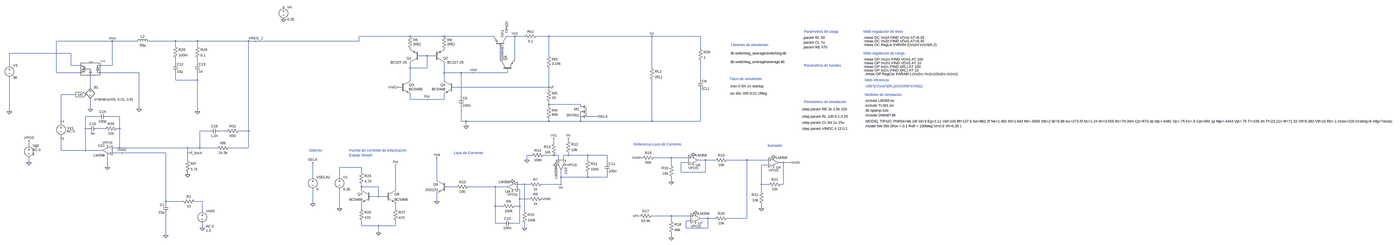
[diagram p0: schematic Regulador_completo_v2_average.asc, whole sheet]
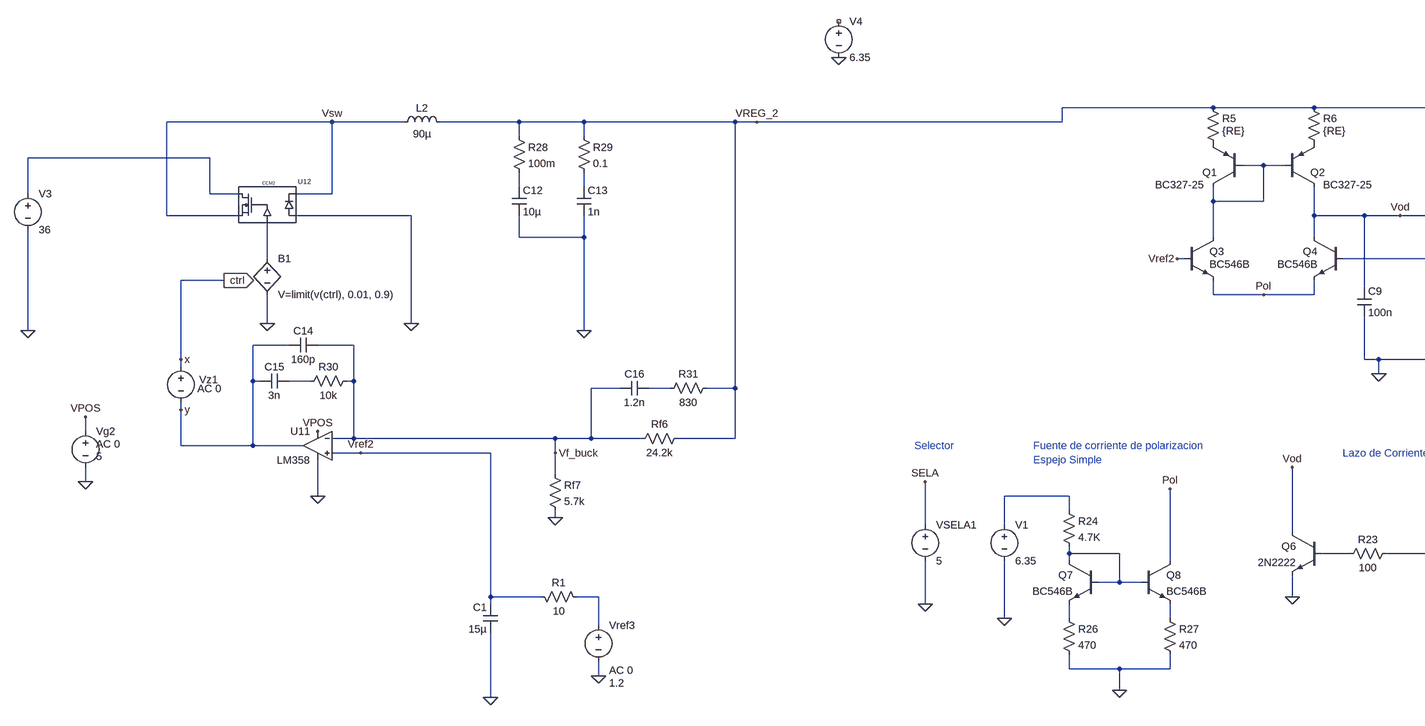
[diagram p1: schematic Regulador_completo_v2_average.asc, part, row 1 of 1, column 1 of 3]
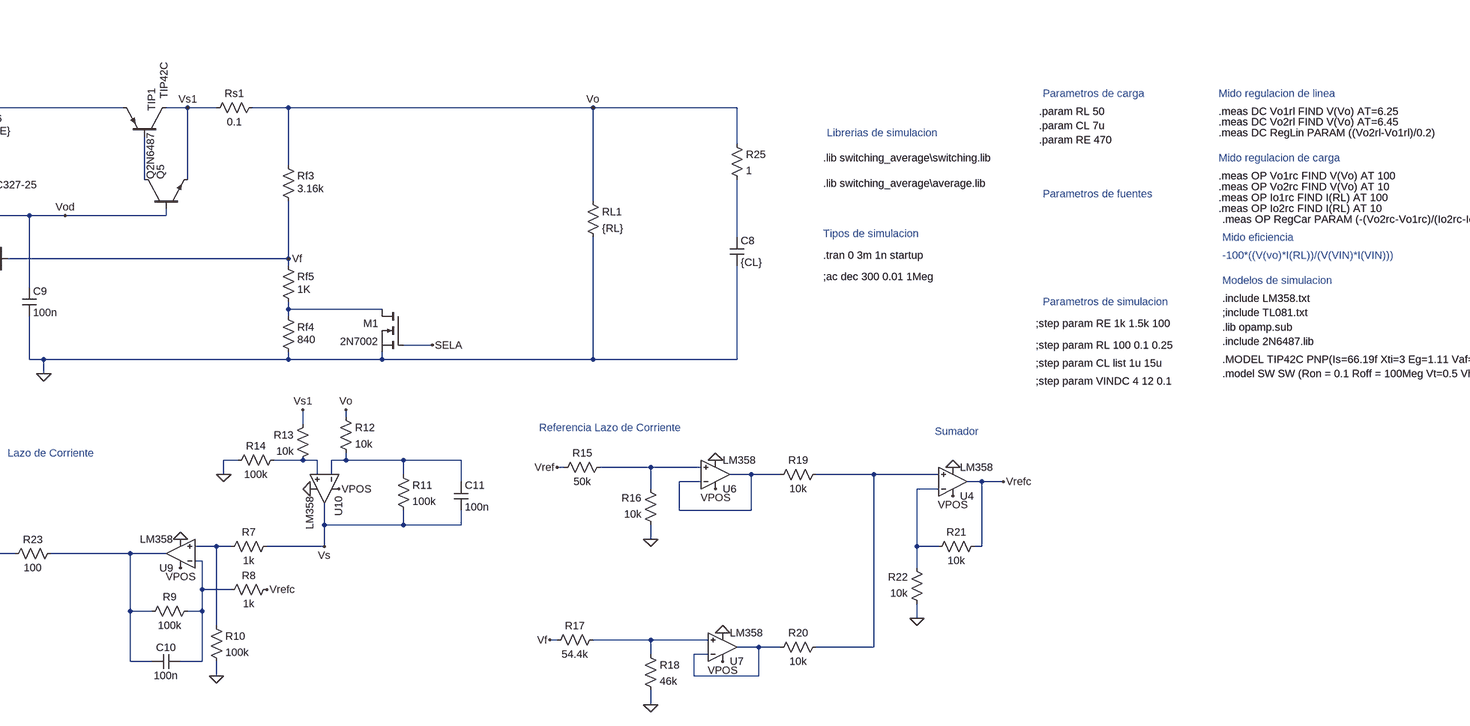
[diagram p2: schematic Regulador_completo_v2_average.asc, part, row 1 of 1, column 2 of 3]
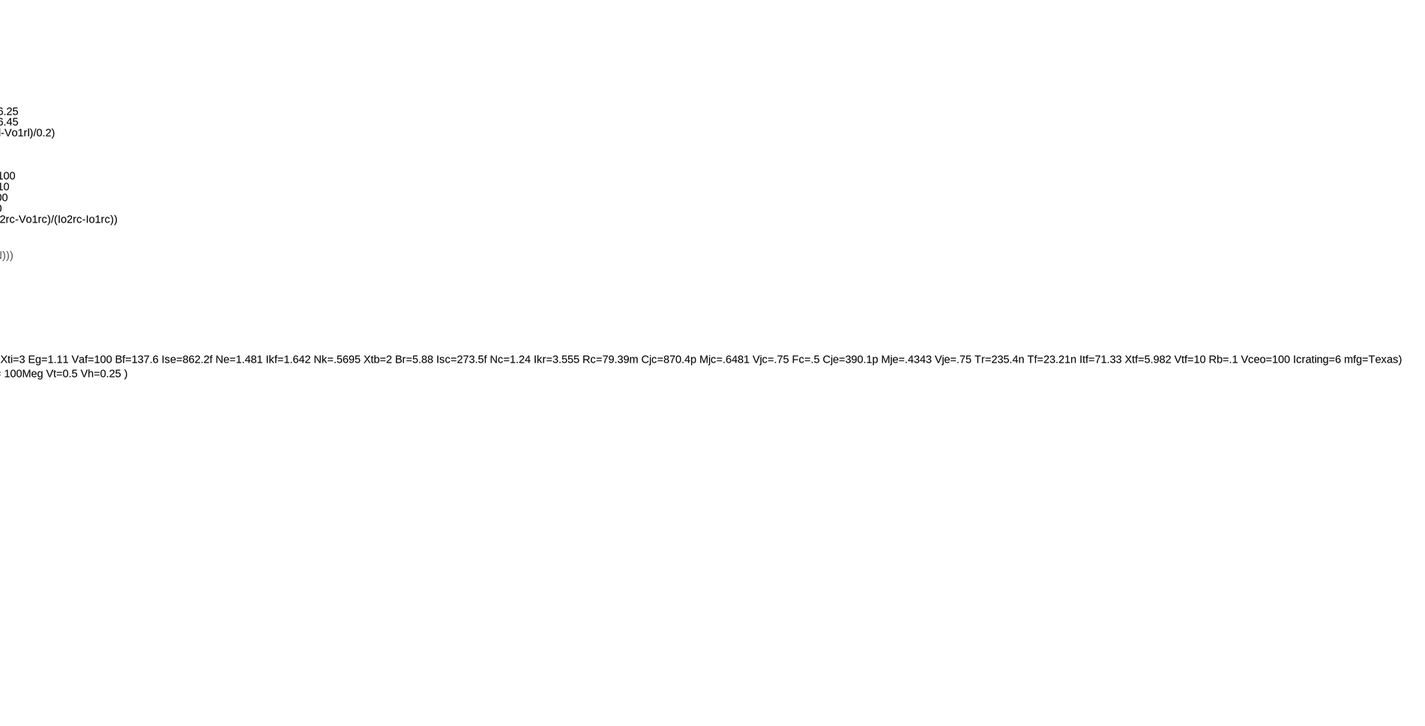
[diagram p3: schematic Regulador_completo_v2_average.asc, part, row 1 of 1, column 3 of 3]
Regulador_completo_v2_average.asc, the LTspice schematic file:
Version 4
SHEET 1 10072 1956
WIRE 3136 -768 2800 -768
WIRE 3360 -768 3136 -768
WIRE 3680 -768 3360 -768
WIRE 3824 -768 3776 -768
WIRE 3888 -768 3824 -768
WIRE 4048 -768 3968 -768
WIRE 4752 -768 4048 -768
WIRE 5072 -768 4752 -768
WIRE 1008 -736 640 -736
WIRE 1168 -736 1008 -736
WIRE 1424 -736 1248 -736
WIRE 1568 -736 1424 -736
WIRE 1904 -736 1568 -736
WIRE 1952 -736 1904 -736
WIRE 2800 -736 2800 -768
WIRE 2800 -736 1952 -736
WIRE 1424 -704 1424 -736
WIRE 1568 -704 1568 -736
WIRE 5072 -688 5072 -768
WIRE 736 -656 272 -656
WIRE 3248 -640 3200 -640
WIRE 3296 -640 3248 -640
WIRE 4048 -640 4048 -768
WIRE 3728 -608 3728 -704
WIRE 3824 -608 3824 -768
WIRE 1424 -592 1424 -624
WIRE 1568 -592 1568 -624
WIRE 272 -576 272 -656
WIRE 736 -576 736 -656
WIRE 800 -576 736 -576
WIRE 1008 -576 1008 -736
WIRE 1008 -576 928 -576
WIRE 3136 -560 3136 -592
WIRE 3248 -560 3248 -640
WIRE 3248 -560 3136 -560
WIRE 4752 -560 4752 -768
WIRE 640 -528 640 -736
WIRE 800 -528 640 -528
WIRE 1184 -528 928 -528
WIRE 3360 -528 3360 -592
WIRE 3472 -528 3360 -528
WIRE 3552 -528 3472 -528
WIRE 3776 -528 3776 -544
WIRE 3776 -528 3552 -528
WIRE 1424 -480 1424 -528
WIRE 1568 -480 1568 -528
WIRE 1568 -480 1424 -480
WIRE 3136 -480 3136 -560
WIRE 3360 -480 3360 -528
WIRE 5072 -480 5072 -608
WIRE 864 -432 864 -512
WIRE 3072 -432 3056 -432
WIRE 4048 -432 4048 -560
WIRE 4048 -432 3424 -432
WIRE 4048 -416 4048 -432
WIRE 768 -384 672 -384
WIRE 3472 -368 3472 -528
WIRE 3136 -352 3136 -384
WIRE 3248 -352 3136 -352
WIRE 3360 -352 3360 -384
WIRE 3360 -352 3248 -352
WIRE 4048 -320 4048 -336
WIRE 4256 -320 4048 -320
WIRE 4048 -304 4048 -320
WIRE 864 -288 864 -352
WIRE 1184 -288 1184 -528
WIRE 272 -272 272 -496
WIRE 1568 -272 1568 -480
WIRE 912 -240 832 -240
WIRE 1056 -240 976 -240
WIRE 4368 -240 4304 -240
WIRE 672 -208 672 -384
WIRE 3472 -208 3472 -304
WIRE 3504 -208 3472 -208
WIRE 4048 -208 4048 -224
WIRE 4048 -208 3504 -208
WIRE 4256 -208 4256 -224
WIRE 4256 -208 4048 -208
WIRE 4752 -208 4752 -480
WIRE 4752 -208 4256 -208
WIRE 5072 -208 5072 -416
WIRE 5072 -208 4752 -208
WIRE 672 -192 672 -208
WIRE 3504 -176 3504 -208
WIRE 832 -160 832 -240
WIRE 848 -160 832 -160
WIRE 960 -160 912 -160
WIRE 1056 -160 1056 -240
WIRE 1056 -160 1040 -160
WIRE 1648 -144 1584 -144
WIRE 1760 -144 1712 -144
WIRE 1904 -144 1904 -736
WIRE 1904 -144 1840 -144
WIRE 672 -96 672 -112
WIRE 4176 -80 4176 -96
WIRE 4080 -64 4080 -96
WIRE 400 -48 400 -80
WIRE 1056 -32 1056 -160
WIRE 1056 -32 1008 -32
WIRE 1504 -32 1056 -32
WIRE 1584 -32 1584 -144
WIRE 1584 -32 1504 -32
WIRE 1696 -32 1584 -32
WIRE 1904 -32 1904 -144
WIRE 1904 -32 1776 -32
WIRE 672 -16 672 -96
WIRE 832 -16 832 -160
WIRE 832 -16 672 -16
WIRE 944 -16 832 -16
WIRE 1072 0 1008 0
WIRE 1360 0 1072 0
WIRE 1504 0 1504 -32
WIRE 3936 16 3904 16
WIRE 4080 16 4016 16
WIRE 4112 16 4080 16
WIRE 4176 16 4176 0
WIRE 4176 16 4144 16
WIRE 4304 16 4176 16
WIRE 4432 16 4304 16
WIRE 4688 32 4672 32
WIRE 4880 32 4768 32
WIRE 4992 32 4880 32
WIRE 1504 48 1504 0
WIRE 3904 48 3904 16
WIRE 4112 48 4112 16
WIRE 4144 48 4144 16
WIRE 4304 48 4304 16
WIRE 5104 48 5056 48
WIRE 5168 48 5104 48
WIRE 5376 48 5248 48
WIRE 5520 48 5376 48
WIRE 400 64 400 32
WIRE 4432 64 4432 16
WIRE 4992 64 4944 64
WIRE 5616 64 5584 64
WIRE 5664 64 5616 64
WIRE 4880 80 4880 32
WIRE 5520 80 5472 80
WIRE 976 96 976 16
WIRE 2816 96 2672 96
WIRE 2816 128 2816 96
WIRE 4944 128 4944 64
WIRE 5104 128 5104 48
WIRE 5104 128 4944 128
WIRE 1504 144 1504 128
WIRE 2496 160 2496 64
WIRE 2672 160 2672 96
WIRE 4128 160 4128 112
WIRE 4304 160 4304 128
WIRE 4304 160 4128 160
WIRE 4432 160 4432 128
WIRE 4432 160 4304 160
WIRE 3312 176 3312 32
WIRE 4880 192 4880 160
WIRE 3888 208 3840 208
WIRE 3920 208 3888 208
WIRE 4128 208 4128 160
WIRE 4128 208 4000 208
WIRE 5472 208 5472 80
WIRE 5520 208 5472 208
WIRE 5616 208 5616 64
WIRE 5616 208 5600 208
WIRE 2816 224 2816 208
WIRE 2928 224 2816 224
WIRE 3440 224 3376 224
WIRE 3696 224 3520 224
WIRE 3776 224 3696 224
WIRE 2816 240 2816 224
WIRE 3040 240 3040 80
WIRE 3856 240 3840 240
WIRE 5472 256 5472 208
WIRE 2928 288 2928 224
WIRE 2928 288 2880 288
WIRE 2976 288 2928 288
WIRE 3856 304 3856 240
WIRE 3920 304 3856 304
WIRE 1360 320 1360 0
WIRE 1472 320 1360 320
WIRE 1600 320 1552 320
WIRE 3312 320 3312 272
WIRE 1360 336 1360 320
WIRE 2496 336 2496 240
WIRE 3696 352 3696 224
WIRE 3744 352 3696 352
WIRE 3856 352 3856 304
WIRE 3856 352 3824 352
WIRE 2672 368 2672 240
WIRE 2816 368 2816 336
WIRE 3040 368 3040 336
WIRE 5472 368 5472 336
WIRE 1600 384 1600 320
WIRE 3888 384 3888 208
WIRE 4672 416 4656 416
WIRE 4880 416 4752 416
WIRE 5008 416 4880 416
WIRE 5120 432 5072 432
WIRE 5168 432 5120 432
WIRE 5376 432 5376 48
WIRE 5376 432 5248 432
WIRE 4880 448 4880 416
WIRE 5008 448 4976 448
WIRE 3696 464 3696 352
WIRE 3744 464 3696 464
WIRE 3856 464 3856 352
WIRE 3856 464 3808 464
WIRE 2816 480 2816 448
WIRE 2928 480 2816 480
WIRE 3040 480 3040 448
WIRE 3040 480 2928 480
WIRE 1600 496 1600 464
WIRE 3888 496 3888 464
WIRE 4976 496 4976 448
WIRE 5120 496 5120 432
WIRE 5120 496 4976 496
WIRE 2928 528 2928 480
WIRE 1360 544 1360 400
WIRE 4880 560 4880 528
FLAG 3504 -176 0
FLAG 4752 -768 Vo
FLAG 4048 -432 Vf
FLAG 3824 -768 Vs1
FLAG 3888 496 0
FLAG 3552 -528 Vod
FLAG 4000 304 Vrefc
FLAG 3904 48 0
FLAG 5472 368 0
FLAG 4880 560 0
FLAG 4880 192 0
FLAG 4368 -240 SELA
FLAG 2496 64 SELA
FLAG 2496 336 0
FLAG 5664 64 Vrefc
FLAG 4128 208 Vs
FLAG 3312 320 0
FLAG 3248 -352 Pol
FLAG 3040 80 Pol
FLAG 2928 528 0
FLAG 4080 -96 Vs1
FLAG 4176 -96 Vo
FLAG 3312 32 Vod
FLAG 4672 32 Vref
FLAG 4656 416 Vf
FLAG 5552 32 0
FLAG 5024 16 0
FLAG 5040 400 0
FLAG 3808 192 0
FLAG 4096 80 0
FLAG 272 -272 0
FLAG 1952 -736 VREG_2
FLAG 1184 -288 0
FLAG 1568 -272 0
FLAG 1008 -736 Vsw
FLAG 1504 144 0
FLAG 976 96 0
FLAG 1600 496 0
FLAG 864 -288 0
FLAG 768 -384 ctrl
IOPIN 768 -384 Out
FLAG 672 -208 x
FLAG 672 -96 y
FLAG 1504 0 Vf_buck
FLAG 400 64 0
FLAG 976 -48 VPOS
FLAG 400 -80 VPOS
FLAG 3808 256 VPOS
FLAG 4160 80 VPOS
FLAG 5024 80 VPOS
FLAG 5040 464 VPOS
FLAG 5552 96 VPOS
FLAG 1072 0 Vref2
FLAG 2672 368 0
FLAG 1360 544 0
FLAG 2304 -880 0
FLAG 3056 -432 Vref2
DATAFLAG 4288 -768 ""
SYMBOL pnp 3200 -592 R180
WINDOW 3 84 4 Left 2
SYMATTR Value BC327-25
SYMATTR InstName Q1
SYMBOL pnp 3296 -592 M180
WINDOW 3 84 4 Left 2
SYMATTR Value BC327-25
SYMATTR InstName Q2
SYMBOL npn 3072 -480 R0
WINDOW 3 56 60 Left 2
SYMATTR Value BC546B
SYMATTR InstName Q3
SYMBOL npn 3424 -480 M0
WINDOW 3 56 60 Left 2
SYMATTR Value BC546B
SYMATTR InstName Q4
SYMBOL pnp 3776 -704 M270
WINDOW 3 84 4 Left 2
SYMATTR Value TIP42C
SYMATTR InstName TIP1
SYMBOL npn 3728 -544 R270
WINDOW 3 65 14 Left 2
WINDOW 0 64 36 Left 2
SYMATTR Value Q2N6487
SYMATTR InstName Q5
SYMBOL res 4032 -656 R0
WINDOW 3 36 68 Left 2
SYMATTR Value 3.16k
SYMATTR InstName Rf3
SYMBOL res 4032 -320 R0
WINDOW 3 36 68 Left 2
SYMATTR Value 840
SYMATTR InstName Rf4
SYMBOL res 4736 -576 R0
SYMATTR InstName RL1
SYMATTR Value {RL}
SYMBOL res 3120 -784 R0
WINDOW 3 36 68 Left 2
SYMATTR Value {RE}
SYMATTR InstName R5
SYMBOL res 3344 -784 R0
WINDOW 3 36 68 Left 2
SYMATTR Value {RE}
SYMATTR InstName R6
SYMBOL cap 5056 -480 R0
SYMATTR InstName C8
SYMATTR Value {CL}
SYMBOL res 3984 -784 R90
WINDOW 0 0 56 VBottom 2
WINDOW 3 32 56 VTop 2
SYMATTR InstName Rs1
SYMATTR Value 0.1
SYMBOL res 4016 192 R90
WINDOW 0 0 56 VBottom 2
WINDOW 3 32 56 VTop 2
SYMATTR InstName R7
SYMATTR Value 1k
SYMBOL res 4016 288 R90
WINDOW 0 0 56 VBottom 2
WINDOW 3 32 56 VTop 2
SYMATTR InstName R8
SYMATTR Value 1k
SYMBOL res 3840 336 R90
WINDOW 0 0 56 VBottom 2
WINDOW 3 32 56 VTop 2
SYMATTR InstName R9
SYMATTR Value 100k
SYMBOL res 3872 368 R0
SYMATTR InstName R10
SYMATTR Value 100k
SYMBOL npn 3376 176 M0
SYMATTR InstName Q6
SYMATTR Value 2N2222
SYMBOL res 4288 32 R0
SYMATTR InstName R11
SYMATTR Value 100k
SYMBOL res 4160 -96 R0
SYMATTR InstName R12
SYMATTR Value 10k
SYMBOL res 4096 -80 M0
SYMATTR InstName R13
SYMATTR Value 10k
SYMBOL res 4032 0 R90
WINDOW 0 0 56 VBottom 2
WINDOW 3 32 56 VTop 2
SYMATTR InstName R14
SYMATTR Value 100k
SYMBOL res 4784 16 R90
WINDOW 0 0 56 VBottom 2
WINDOW 3 32 56 VTop 2
SYMATTR InstName R15
SYMATTR Value 50k
SYMBOL res 4896 176 R180
WINDOW 0 36 76 Left 2
WINDOW 3 36 40 Left 2
SYMATTR InstName R16
SYMATTR Value 10k
SYMBOL res 4656 432 R270
WINDOW 0 32 56 VTop 2
WINDOW 3 0 56 VBottom 2
SYMATTR InstName R17
SYMATTR Value 54.4k
SYMBOL res 4864 432 R0
SYMATTR InstName R18
SYMATTR Value 46k
SYMBOL res 5264 32 R90
WINDOW 0 0 56 VBottom 2
WINDOW 3 32 56 VTop 2
SYMATTR InstName R19
SYMATTR Value 10k
SYMBOL res 5264 416 R90
WINDOW 0 0 56 VBottom 2
WINDOW 3 32 56 VTop 2
SYMATTR InstName R20
SYMATTR Value 10k
SYMBOL res 5616 192 R90
WINDOW 0 0 56 VBottom 2
WINDOW 3 32 56 VTop 2
SYMATTR InstName R21
SYMATTR Value 10k
SYMBOL res 5488 352 R180
WINDOW 0 36 76 Left 2
WINDOW 3 36 40 Left 2
SYMATTR InstName R22
SYMATTR Value 10k
SYMBOL res 4032 -432 R0
WINDOW 3 36 68 Left 2
SYMATTR Value 1K
SYMATTR InstName Rf5
SYMBOL nmos 4304 -320 M0
SYMATTR InstName M1
SYMATTR Value 2N7002
SYMBOL voltage 2496 144 R0
WINDOW 123 0 0 Left 2
WINDOW 39 0 0 Left 2
SYMATTR InstName VSELA1
SYMATTR Value 5
SYMBOL res 3536 208 R90
WINDOW 0 0 56 VBottom 2
WINDOW 3 32 56 VTop 2
SYMATTR InstName R23
SYMATTR Value 100
SYMBOL npn 2880 240 M0
SYMATTR InstName Q7
SYMATTR Value BC546B
SYMBOL res 2800 112 R0
SYMATTR InstName R24
SYMATTR Value 4.7K
SYMBOL npn 2976 240 R0
SYMATTR InstName Q8
SYMATTR Value BC546B
SYMBOL cap 3456 -368 R0
SYMATTR InstName C9
SYMATTR Value 100n
SYMBOL Opamps\\opamp2 5552 128 M180
SYMATTR InstName U4
SYMATTR Value LM358
SYMBOL Opamps\\opamp2 5024 112 M180
SYMATTR InstName U6
SYMATTR Value LM358
SYMBOL Opamps\\opamp2 5040 496 M180
SYMATTR InstName U7
SYMATTR Value LM358
SYMBOL Opamps\\opamp2 3808 288 R180
SYMATTR InstName U9
SYMATTR Value LM358
SYMBOL Opamps\\opamp2 4192 80 R90
SYMATTR InstName U10
SYMATTR Value LM358
SYMBOL res 5056 -704 R0
SYMATTR InstName R25
SYMATTR Value 1
SYMBOL res 2800 352 R0
SYMATTR InstName R26
SYMATTR Value 470
SYMBOL res 3024 352 R0
SYMATTR InstName R27
SYMATTR Value 470
SYMBOL cap 3808 448 R90
WINDOW 0 0 32 VBottom 2
WINDOW 3 32 32 VTop 2
SYMATTR InstName C10
SYMATTR Value 100n
SYMBOL cap 4416 64 R0
SYMATTR InstName C11
SYMATTR Value 100n
SYMBOL voltage 272 -592 R0
WINDOW 123 0 0 Left 0
WINDOW 39 0 0 Left 0
SYMATTR InstName V3
SYMATTR Value 36
SYMBOL ind 1152 -720 R270
WINDOW 0 32 56 VTop 2
WINDOW 3 5 56 VBottom 2
SYMATTR InstName L2
SYMATTR Value 90µ
SYMBOL cap 1408 -592 R0
SYMATTR InstName C12
SYMATTR Value 10µ
SYMBOL cap 1552 -592 R0
SYMATTR InstName C13
SYMATTR Value 1n
SYMBOL res 1408 -720 R0
SYMATTR InstName R28
SYMATTR Value 100m
SYMBOL res 1552 -720 R0
SYMATTR InstName R29
SYMATTR Value 0.1
SYMBOL res 1792 -48 R90
WINDOW 0 0 56 VBottom 2
WINDOW 3 32 56 VTop 2
SYMATTR InstName Rf6
SYMATTR Value 24.2k
SYMBOL res 1488 32 R0
SYMATTR InstName Rf7
SYMATTR Value 5.7k
SYMBOL voltage 1600 368 R0
WINDOW 123 24 116 Left 2
WINDOW 39 0 0 Left 2
WINDOW 3 24 144 Left 2
SYMATTR Value2 AC 0
SYMATTR InstName Vref3
SYMATTR Value 1.2
SYMBOL bv 864 -448 R0
SYMATTR InstName B1
SYMATTR Value V=limit(v(ctrl), 0.01, 0.9)
SYMBOL voltage 672 -208 R0
WINDOW 0 41 45 Left 2
WINDOW 123 37 65 Left 2
WINDOW 39 0 0 Left 2
SYMATTR InstName Vz1
SYMATTR Value2 AC 0
SYMATTR Value ""
SYMBOL voltage 400 -64 R0
WINDOW 123 24 44 Left 2
WINDOW 39 0 0 Left 0
WINDOW 3 24 72 Left 2
SYMATTR Value2 AC 0
SYMATTR InstName Vg2
SYMATTR Value 5
SYMBOL Opamps\\opamp2 976 -80 M0
SYMATTR InstName U11
SYMATTR Value LM358
SYMBOL cap 976 -256 R90
WINDOW 0 0 32 VBottom 2
WINDOW 3 32 32 VTop 2
SYMATTR InstName C14
SYMATTR Value 160p
SYMBOL cap 912 -176 R90
WINDOW 0 0 32 VBottom 2
WINDOW 3 32 32 VTop 2
SYMATTR InstName C15
SYMATTR Value 3n
SYMBOL res 1056 -176 R90
WINDOW 0 0 56 VBottom 2
WINDOW 3 32 56 VTop 2
SYMATTR InstName R30
SYMATTR Value 10k
SYMBOL cap 1712 -160 R90
WINDOW 0 0 32 VBottom 2
WINDOW 3 32 32 VTop 2
SYMATTR InstName C16
SYMATTR Value 1.2n
SYMBOL res 1856 -160 R90
WINDOW 0 0 56 VBottom 2
WINDOW 3 32 56 VTop 2
SYMATTR InstName R31
SYMATTR Value 830
SYMBOL ccm1 864 -544 R0
SYMATTR InstName U12
SYMATTR Value CCM2
SYMATTR SpiceLine Ron=0.16
SYMATTR SpiceLine2 VD=0 RD=0.16
SYMBOL voltage 2672 144 R0
WINDOW 123 0 0 Left 0
WINDOW 39 0 0 Left 0
SYMATTR InstName V1
SYMATTR Value 6.35
SYMBOL res 1456 304 M90
WINDOW 0 0 56 VBottom 2
WINDOW 3 32 56 VTop 2
SYMATTR InstName R1
SYMATTR Value 10
SYMBOL cap 1376 336 M0
SYMATTR InstName C1
SYMATTR Value 15µ
SYMBOL voltage 2304 -976 R0
WINDOW 123 0 0 Left 0
WINDOW 39 0 0 Left 0
SYMATTR InstName V4
SYMATTR Value 6.35
TEXT 5264 -656 Left 2 !.lib switching_average\\switching.lib
TEXT 5264 -600 Left 2 !.lib switching_average\\average.lib
TEXT 5272 -712 Left 2 ;Librerias de simulacion
TEXT 5264 -440 Left 2 !.tran 0 3m 1n startup
TEXT 5264 -392 Left 2 !;ac dec 300 0.01 1Meg
TEXT 5264 -488 Left 2 ;Tipos de simulacion
TEXT 5744 -760 Left 2 !.param RL 50
TEXT 5736 -288 Left 2 !;step param RE 1k 1.5k 100
TEXT 5744 -696 Left 2 !.param RE 470
TEXT 5736 -240 Left 2 !;step param RL 100 0.1 0.25
TEXT 6208 -800 Left 2 ;Mido regulacion de linea
TEXT 6208 -760 Left 2 !.meas DC Vo1rl FIND V(Vo) AT=6.25
TEXT 6208 -736 Left 2 !.meas DC Vo2rl FIND V(Vo) AT=6.45
TEXT 6208 -712 Left 2 !.meas DC RegLin PARAM ((Vo2rl-Vo1rl)/0.2)
TEXT 6208 -656 Left 2 ;Mido regulacion de carga
TEXT 6208 -616 Left 2 !.meas OP Vo1rc FIND V(Vo) AT 100
TEXT 6208 -592 Left 2 !.meas OP Vo2rc FIND V(Vo) AT 10
TEXT 6208 -568 Left 2 !.meas OP Io1rc FIND I(RL) AT 100
TEXT 6208 -544 Left 2 !.meas OP Io2rc FIND I(RL) AT 10
TEXT 6216 -480 Left 2 ;Mido eficiencia
TEXT 6216 -440 Left 2 ;-100*((V(vo)*I(RL))/(V(VIN)*I(VIN)))
TEXT 6216 -520 Left 2 !.meas OP RegCar PARAM (-(Vo2rc-Vo1rc)/(Io2rc-Io1rc))
TEXT 3424 0 Left 2 ;Lazo de Corriente
TEXT 6216 -312 Left 2 !;include TL081.txt
TEXT 4632 -56 Left 2 ;Referencia Lazo de Corriente
TEXT 5736 -160 Left 2 !;step param VINDC 4 12 0.1
TEXT 5512 -48 Left 2 ;Sumador
TEXT 2472 -16 Left 2 ;Selector
TEXT 6216 -280 Left 2 !.lib opamp.sub
TEXT 2736 -16 Left 2 ;Fuente de corriente de polarizacion\nEspejo Simple
TEXT 5744 -728 Left 2 !.param CL 7u
TEXT 5752 -800 Left 2 ;Parametros de carga
TEXT 5752 -576 Left 2 ;Parametros de fuentes
TEXT 5752 -336 Left 2 ;Parametros de simulacion
TEXT 6216 -384 Left 2 ;Modelos de simulacion
TEXT 5736 -200 Left 2 !;step param CL list 1u 15u
TEXT 6216 -208 Left 2 !.MODEL TIP42C PNP(Is=66.19f Xti=3 Eg=1.11 Vaf=100 Bf=137.6 Ise=862.2f Ne=1.481 Ikf=1.642 Nk=.5695 Xtb=2 Br=5.88 Isc=273.5f Nc=1.24 Ikr=3.555 Rc=79.39m Cjc=870.4p Mjc=.6481 Vjc=.75 Fc=.5 Cje=390.1p Mje=.4343 Vje=.75 Tr=235.4n Tf=23.21n Itf=71.33 Xtf=5.982 Vtf=10 Rb=.1 Vceo=100 Icrating=6 mfg=Texas)
TEXT 6216 -248 Left 2 !.include 2N6487.lib
TEXT 6216 -344 Left 2 !.include LM358.txt
TEXT 6216 -176 Left 2 !.model SW SW (Ron = 0.1 Roff = 100Meg Vt=0.5 Vh=0.25 )

The netlist it stands for:
* Regulador_completo_v2_average.asc
Q1 N002 N002 P001 0 BC327-25
Q2 Vod N002 P002 0 BC327-25
Q3 N002 Vref2 Pol 0 BC546B
Q4 Vod Vf Pol 0 BC546B
Q§TIP1 Vs1 N003 VREG_2 0 TIP42C
Q5 N003 Vod Vs1 0 Q2N6487
Rf3 Vo Vf 3.16k
Rf4 N008 0 840
RL1 Vo 0 {RL}
R5 VREG_2 P001 {RE}
R6 VREG_2 P002 {RE}
C8 N006 0 {CL}
Rs1 Vo Vs1 0.1
R7 Vs N018 1k
R8 Vrefc N022 1k
R9 N022 N021 100k
R10 N018 0 100k
Q6 Vod N020 0 0 2N2222
R11 N012 Vs 100k
R12 Vo N012 10k
R13 Vs1 N011 10k
R14 N011 0 100k
R15 N013 Vref 50k
R16 0 N013 10k
R17 Vf N026 54.4k
R18 N026 0 46k
R19 N015 N014 10k
R20 N015 N027 10k
R21 Vrefc N016 10k
R22 0 N016 10k
Rf5 Vf N008 1K
M1 N008 SELA 0 0 2N7002
VSELA1 SELA 0 5
R23 N021 N020 100
Q7 N019 N019 N024 0 BC546B
R24 N017 N019 4.7K
Q8 Pol N019 N025 0 BC546B
C9 Vod 0 100n
XU4 N015 N016 VPOS 0 Vrefc LM358  ; pins In+ In- V+ V- OUT
XU6 N013 N014 VPOS 0 N014 LM358  ; pins In+ In- V+ V- OUT
XU7 N026 N027 VPOS 0 N027 LM358  ; pins In+ In- V+ V- OUT
XU9 N018 N022 VPOS 0 N021 LM358  ; pins In+ In- V+ V- OUT
XU10 N011 N012 VPOS 0 Vs LM358  ; pins In+ In- V+ V- OUT
R25 Vo N006 1
R26 N024 0 470
R27 N025 0 470
C10 N022 N021 100n
C11 N012 Vs 100n
V3 N001 0 36
L2 Vsw VREG_2 90µ
C12 N004 0 10µ
C13 N005 0 1n
R28 VREG_2 N004 100m
R29 VREG_2 N005 0.1
Rf6 VREG_2 Vf_buck 24.2k
Rf7 Vf_buck 0 5.7k
Vref3 N023 0 1.2 AC 0
B1 N007 0 V=limit(v(ctrl), 0.01, 0.9)
Vz1 x y AC 0
Vg2 VPOS 0 5 AC 0
XU11 Vref2 Vf_buck VPOS 0 y LM358  ; pins In+ In- V+ V- OUT
C14 Vf_buck y 160p
C15 N009 y 3n
R30 Vf_buck N009 10k
C16 N010 Vf_buck 1.2n
R31 VREG_2 N010 830
XU12 N001 Vsw Vsw 0 N007 CCM2 Ron=0.16 VD=0 RD=0.16  ; pins 1 2 3 4 5
V1 N017 0 6.35
R1 Vref2 N023 10
C1 Vref2 0 15µ
V4 NC_01 0 6.35
.model NPN NPN
.model PNP PNP
.lib standard.bjt
.model NMOS NMOS
.model PMOS PMOS
.lib standard.mos
.lib switching_average\switching.lib
.lib switching_average\average.lib
* Librerias de simulacion
.tran 0 3m 1n startup
;ac dec 300 0.01 1Meg
* Tipos de simulacion
.param RL 50
;step param RE 1k 1.5k 100
.param RE 470
;step param RL 100 0.1 0.25
* Mido regulacion de linea
.meas DC Vo1rl FIND V(Vo) AT=6.25
.meas DC Vo2rl FIND V(Vo) AT=6.45
.meas DC RegLin PARAM ((Vo2rl-Vo1rl)/0.2)
* Mido regulacion de carga
.meas OP Vo1rc FIND V(Vo) AT 100
.meas OP Vo2rc FIND V(Vo) AT 10
.meas OP Io1rc FIND I(RL) AT 100
.meas OP Io2rc FIND I(RL) AT 10
* Mido eficiencia
* -100*((V(vo)*I(RL))/(V(VIN)*I(VIN)))
.meas OP RegCar PARAM (-(Vo2rc-Vo1rc)/(Io2rc-Io1rc))
* Lazo de Corriente
;include TL081.txt
* Referencia Lazo de Corriente
;step param VINDC 4 12 0.1
* Sumador
* Selector
.lib opamp.sub
* Fuente de corriente de polarizacion
* Espejo Simple
.param CL 7u
* Parametros de carga
* Parametros de fuentes
* Parametros de simulacion
* Modelos de simulacion
;step param CL list 1u 15u
.MODEL TIP42C PNP(Is=66.19f Xti=3 Eg=1.11 Vaf=100 Bf=137.6 Ise=862.2f Ne=1.481 Ikf=1.642 Nk=.5695 Xtb=2 Br=5.88 Isc=273.5f Nc=1.24 Ikr=3.555 Rc=79.39m Cjc=870.4p Mjc=.6481 Vjc=.75 Fc=.5 Cje=390.1p Mje=.4343 Vje=.75 Tr=235.4n Tf=23.21n Itf=71.33 Xtf=5.982 Vtf=10 Rb=.1 Vceo=100 Icrating=6 mfg=Texas)
.include 2N6487.lib
.include LM358.txt
.model SW SW (Ron = 0.1 Roff = 100Meg Vt=0.5 Vh=0.25 )
.backanno
.end